# Altium schematic sheet i2c_stuff.SchDoc
size A4
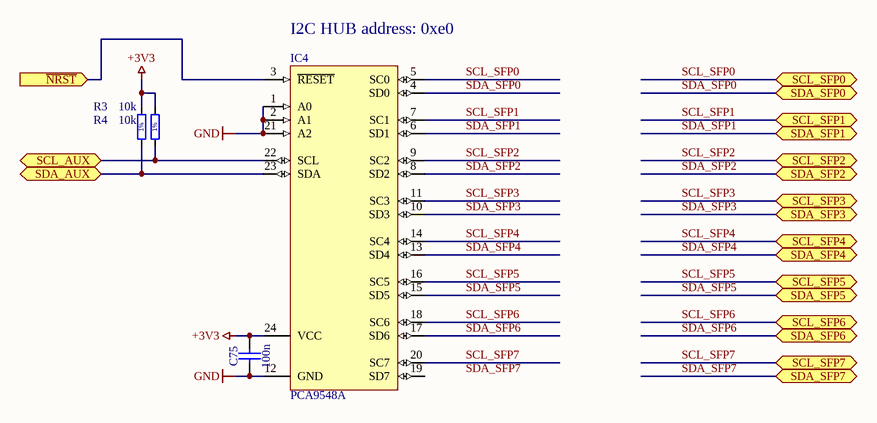
[diagram p0: i2c_stuff.SchDoc]

## Parts
C75  100n  [CAPC1608X87N]
IC4  PCA9548A  [TSOP65P640-24AL]
R3  10k  [RESC1608X55N]
R4  10k  [RESC1608X55N]

## Ports
SCL_AUX (bidir), SCL_SFP0 (bidir), SCL_SFP1 (bidir), SCL_SFP2 (bidir), SCL_SFP3 (bidir), SCL_SFP4 (bidir), SCL_SFP5 (bidir), SCL_SFP6 (bidir), SCL_SFP7 (bidir), SDA_AUX (bidir), SDA_SFP0 (bidir), SDA_SFP1 (bidir), SDA_SFP2 (bidir), SDA_SFP3 (bidir), SDA_SFP4 (bidir), SDA_SFP5 (bidir), SDA_SFP6 (bidir), SDA_SFP7 (bidir), ~{NRST} (in)

## Nets
+3V3: C75.2 IC4.24(VCC) R3.2 R4.2
GND: C75.1 IC4.1(A0) IC4.2(A1) IC4.12(GND) IC4.21(A2)
~{NRST}: IC4.3(~{RESET}) ; port ~{NRST}
SCL_AUX: IC4.22(SCL) R3.1 ; port SCL_AUX
SCL_SFP0: IC4.5(SC0) ; port SCL_SFP0
SCL_SFP1: IC4.7(SC1) ; port SCL_SFP1
SCL_SFP2: IC4.9(SC2) ; port SCL_SFP2
SCL_SFP3: IC4.11(SC3) ; port SCL_SFP3
SCL_SFP4: IC4.14(SC4) ; port SCL_SFP4
SCL_SFP5: IC4.16(SC5) ; port SCL_SFP5
SCL_SFP6: IC4.18(SC6) ; port SCL_SFP6
SCL_SFP7: IC4.20(SC7) ; port SCL_SFP7
SDA_AUX: IC4.23(SDA) R4.1 ; port SDA_AUX
SDA_SFP0: IC4.4(SD0) ; port SDA_SFP0
SDA_SFP1: IC4.6(SD1) ; port SDA_SFP1
SDA_SFP2: IC4.8(SD2) ; port SDA_SFP2
SDA_SFP3: IC4.10(SD3) ; port SDA_SFP3
SDA_SFP4: IC4.13(SD4) ; port SDA_SFP4
SDA_SFP5: IC4.15(SD5) ; port SDA_SFP5
SDA_SFP6: IC4.17(SD6) ; port SDA_SFP6
SDA_SFP7: port SDA_SFP7

Not connected (* = marked no-connect by the designer): IC4 19(SD7)

## Notes on the sheet
- (near IC4) I2C HUB address: 0xe0
- Labels drawn without touching a wire or pin: SDA_SFP7
- (in symbol R0603_10K_1%_0.1W_100PPM) 1%

## Library data of the parts
C75 = CC0603_100NF_50V_10%_X7R: Non-polarised capacitor; Part Description: SMD Multilayer Chip Ceramic Capacitor; Manufacturer: GENERIC; Manufacturer1 Part Number: 223858615649; Manufacturer1 Datasheet: \\cern.ch\dfs\Applications\Altium\Datasheets\CC0603_X7R_PHYCOMP.pdf; Value: 100nF; Voltage: 50V; TC: X7R; Tolerance: ±10%; Table: Capacitors SMD; Part Number: CC0603_100NF_50V_10%_X7R; Component Kind: Standard; Component Type: Standard; Designator: Capacitor - non polarized; Library Reference: Capacitor - non polarized; Pin Count: 2; Status: Preferred; Manufacturer Part Number: CC0603_100NF_50V_10%_X7R; Case: 0603; Mounted: Yes; Socket: No; SMD: Yes; Manufacturer1 Example: PHYCOMP; Manufacturer1 ComponentHeight: 0.87mm; HelpURL: \\cern.ch\dfs\Applications\Altium\Datasheets\CC0603_X7R_PHYCOMP.pdf; Author: CERN DEM JLC; CreateDate: 12/3/2007; LatestRevisionDate: 12/3/2007
IC4 = PCA9548A: 1-to-8 I2C bus mux; RefId: 1607855; Value: PCA9548APWR; Supplier: Farnell
R3 R4 = R0603_10K_1%_0.1W_100PPM: Resistor - 1%; Part Description: General Purpose Thick Film Chip Resistor; Manufacturer: GENERIC; Manufacturer1 Part Number: NRC06F1002TRF; Power: 0.1W; TC: ±100ppm/°C; Table: Resistors SMD; Part Number: R0603_10K_1%_0.1W_100PPM; Component Kind: Standard; Component Type: Standard; Pin Count: 2; Value: 10k; Status: Preferred; Tolerance: ±1%; Manufacturer Part Number: R0603_10K_1%_0.1W_100PPM; Case: 0603; Mounted: Yes; Socket: No; SMD: Yes; Manufacturer1 Example: NIC COMPONENT; Manufacturer1 ComponentHeight: 0.55mm; HelpURL: \\cern.ch\dfs\Applications\Altium\Datasheets\R0603_NIC_NRC.pdf; Author: CERN DEM JLC; CreateDate: 12/3/2007; LatestRevisionDate: 3/13/2008